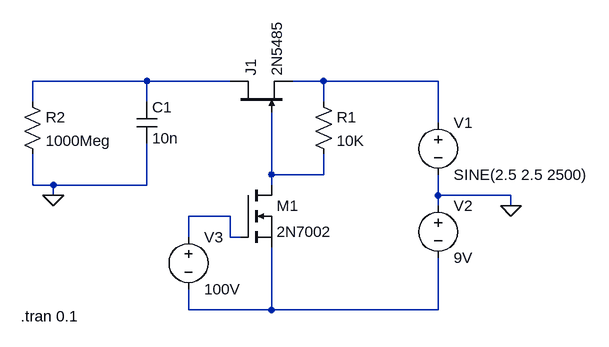
[diagram p0: schematic r1_singlejfet.asc]
r1_singlejfet.asc, the LTspice schematic file:
Version 4
SHEET 1 880 708
WIRE -16 192 -192 192
WIRE 112 192 -16 192
WIRE 256 192 208 192
WIRE 432 192 256 192
WIRE -192 224 -192 192
WIRE -16 224 -16 192
WIRE 256 224 256 192
WIRE 432 256 432 192
WIRE 176 336 176 240
WIRE 256 336 256 304
WIRE 256 336 176 336
WIRE -192 352 -192 304
WIRE -160 352 -192 352
WIRE -16 352 -16 288
WIRE -16 352 -160 352
WIRE 176 352 176 336
WIRE -160 368 -160 352
WIRE 432 368 432 336
WIRE 544 368 432 368
WIRE 432 384 432 368
WIRE 544 384 544 368
WIRE 112 400 48 400
WIRE 48 432 48 400
WIRE 112 432 112 400
WIRE 128 432 112 432
WIRE 48 544 48 512
WIRE 176 544 176 448
WIRE 176 544 48 544
WIRE 432 544 432 464
WIRE 432 544 176 544
FLAG 544 384 0
FLAG -160 368 0
SYMBOL njf 112 240 R270
SYMATTR InstName J1
SYMATTR Value 2N5485
SYMBOL res 240 208 R0
SYMATTR InstName R1
SYMATTR Value 10K
SYMBOL nmos 128 352 R0
SYMATTR InstName M1
SYMATTR Value 2N7002
SYMBOL voltage 432 240 R0
WINDOW 123 0 0 Left 0
WINDOW 39 0 0 Left 0
SYMATTR InstName V1
SYMATTR Value SINE(2.5 2.5 2500)
SYMBOL voltage 432 368 R0
WINDOW 123 0 0 Left 0
WINDOW 39 0 0 Left 0
SYMATTR InstName V2
SYMATTR Value 9V
SYMBOL cap -32 224 R0
SYMATTR InstName C1
SYMATTR Value 10n
SYMBOL res -208 208 R0
SYMATTR InstName R2
SYMATTR Value 1000Meg
SYMBOL voltage 48 416 R0
WINDOW 123 0 0 Left 0
WINDOW 39 0 0 Left 0
SYMATTR InstName V3
SYMATTR Value 100V
TEXT -210 554 Left 2 !.tran 0.1

The netlist it stands for:
* r1_singlejfet.asc
J1 N001 N003 N002 2N5485
R1 N002 N003 10K
M1 N003 N004 N005 N005 2N7002
V1 N002 0 SINE(2.5 2.5 2500)
V2 0 N005 9V
C1 N001 0 10n
R2 N001 0 1000Meg
V3 N004 N005 100V
.model NJF NJF
.model PJF PJF
.lib standard.jft
.model NMOS NMOS
.model PMOS PMOS
.lib standard.mos
.tran 0.1
.backanno
.end